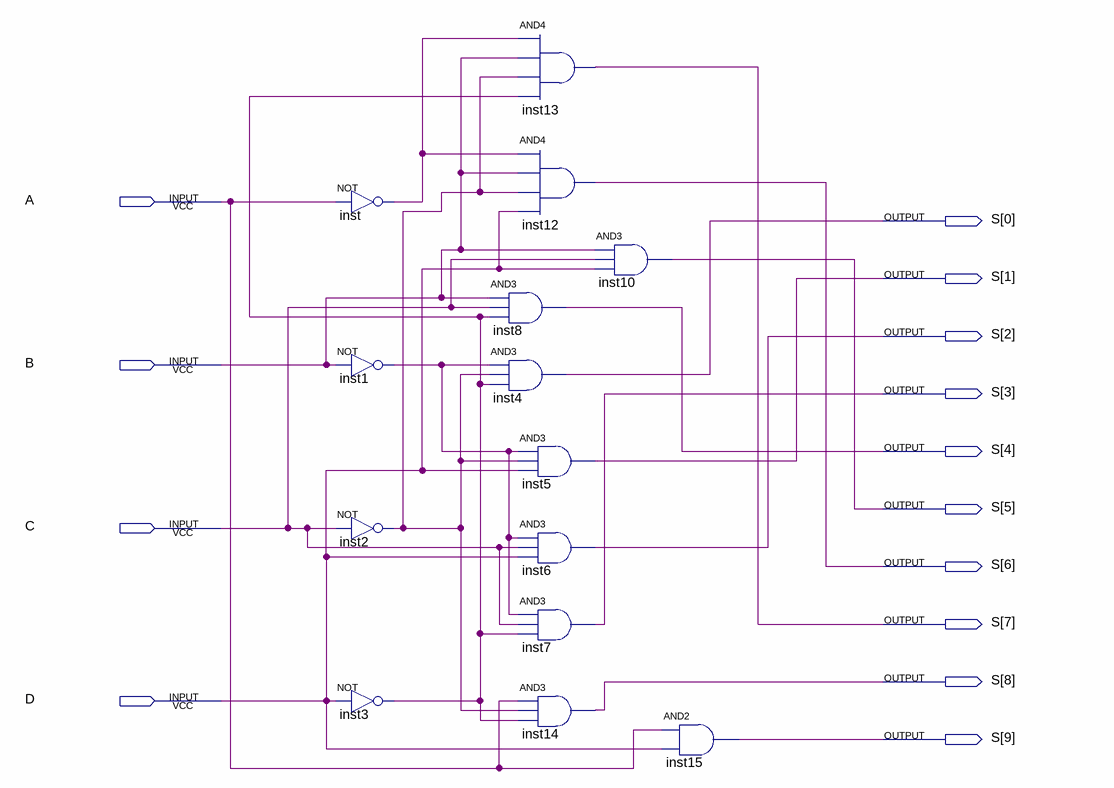
[diagram p0: schematic sheet]
// Quartus schematic Exp5.bdf as structural Verilog: 14 symbols, 14 pins
module Exp5 (
  input  A,
  input  B,
  input  C,
  input  D,
  output [9:0] S
);

  wire inst1_out, inst2_out, inst3_out, inst_out;

  not inst (inst_out, A);
  not inst1 (inst1_out, B);
  not inst2 (inst2_out, C);
  not inst3 (inst3_out, D);
  and inst13 (S[7], inst_out, B, inst2_out, inst3_out);
  and inst12 (S[6], inst_out, B, inst2_out, D);
  and inst8 (S[4], B, C, inst3_out);
  and inst4 (S[0], inst1_out, inst2_out, inst3_out);
  and inst5 (S[1], inst1_out, inst2_out, D);
  and inst6 (S[2], inst1_out, C, D);
  and inst7 (S[3], inst1_out, C, inst3_out);
  and inst14 (S[8], A, inst2_out, inst3_out);
  and inst10 (S[5], B, C, D);
  and inst15 (S[9], A, D);
endmodule
